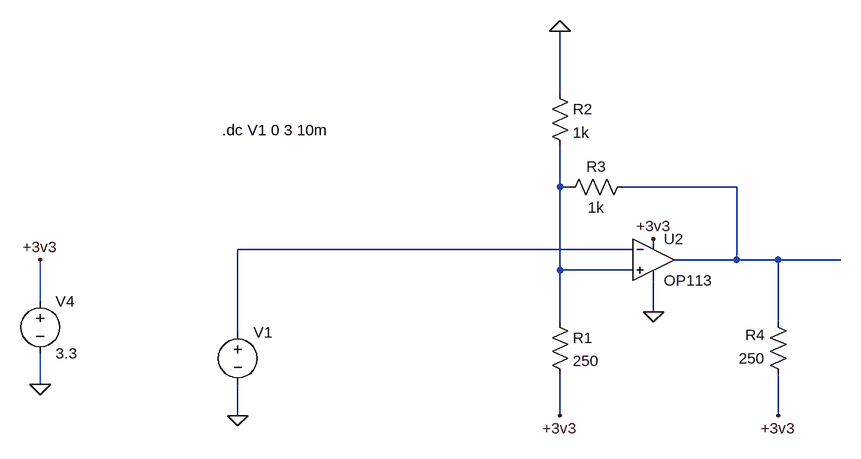
[diagram p0: schematic SchmittTrigger_Version_1.asc]
SchmittTrigger_Version_1.asc, the LTspice schematic file:
Version 4
SHEET 1 880 680
WIRE 176 -96 176 -192
WIRE 176 48 176 -16
WIRE 192 48 176 48
WIRE 448 48 272 48
WIRE 288 144 -320 144
WIRE 448 160 448 48
WIRE 448 160 352 160
WIRE 512 160 448 160
WIRE 608 160 512 160
WIRE 176 176 176 48
WIRE 288 176 176 176
WIRE -624 224 -624 160
WIRE 320 240 320 192
WIRE 176 256 176 176
WIRE 512 256 512 160
WIRE -320 272 -320 144
WIRE -624 352 -624 304
WIRE -320 400 -320 352
WIRE 176 400 176 336
WIRE 512 400 512 336
FLAG -320 400 0
FLAG 176 -192 0
FLAG 320 240 0
FLAG -624 352 0
FLAG -624 160 +3v3
FLAG 320 128 +3v3
FLAG 176 400 +3v3
FLAG 512 400 +3v3
SYMBOL voltage -320 256 R0
WINDOW 123 0 0 Left 0
WINDOW 39 0 0 Left 0
SYMATTR InstName V1
SYMATTR Value ""
SYMBOL res 160 240 R0
SYMATTR InstName R1
SYMATTR Value 250
SYMBOL res 160 -112 R0
SYMATTR InstName R2
SYMATTR Value 1k
SYMBOL res 288 32 R90
WINDOW 0 0 56 VBottom 2
WINDOW 3 32 56 VTop 2
SYMATTR InstName R3
SYMATTR Value 1k
SYMBOL res 528 352 R180
WINDOW 0 36 76 Left 2
WINDOW 3 36 40 Left 2
SYMATTR InstName R4
SYMATTR Value 250
SYMBOL voltage -624 208 R0
WINDOW 123 0 0 Left 0
WINDOW 39 0 0 Left 0
SYMATTR InstName V4
SYMATTR Value 3.3
SYMBOL Opamps\\OP113 320 96 R0
SYMATTR InstName U2
TEXT -344 -40 Left 2 !.dc V1 0 3 10m

The netlist it stands for:
* SchmittTrigger_Version_1.asc
V1 N003 0
R1 N001 +3v3 250
R2 0 N001 1k
R3 N002 N001 1k
R4 +3v3 N002 250
V4 +3v3 0 3.3
XU2 N001 N003 +3v3 0 N002 OP113  ; pins In+ In- V+ V- OUT
.dc V1 0 3 10m
.lib ADI.lib
.backanno
.end